# Altium project GeneralMainModule.PrjPcb
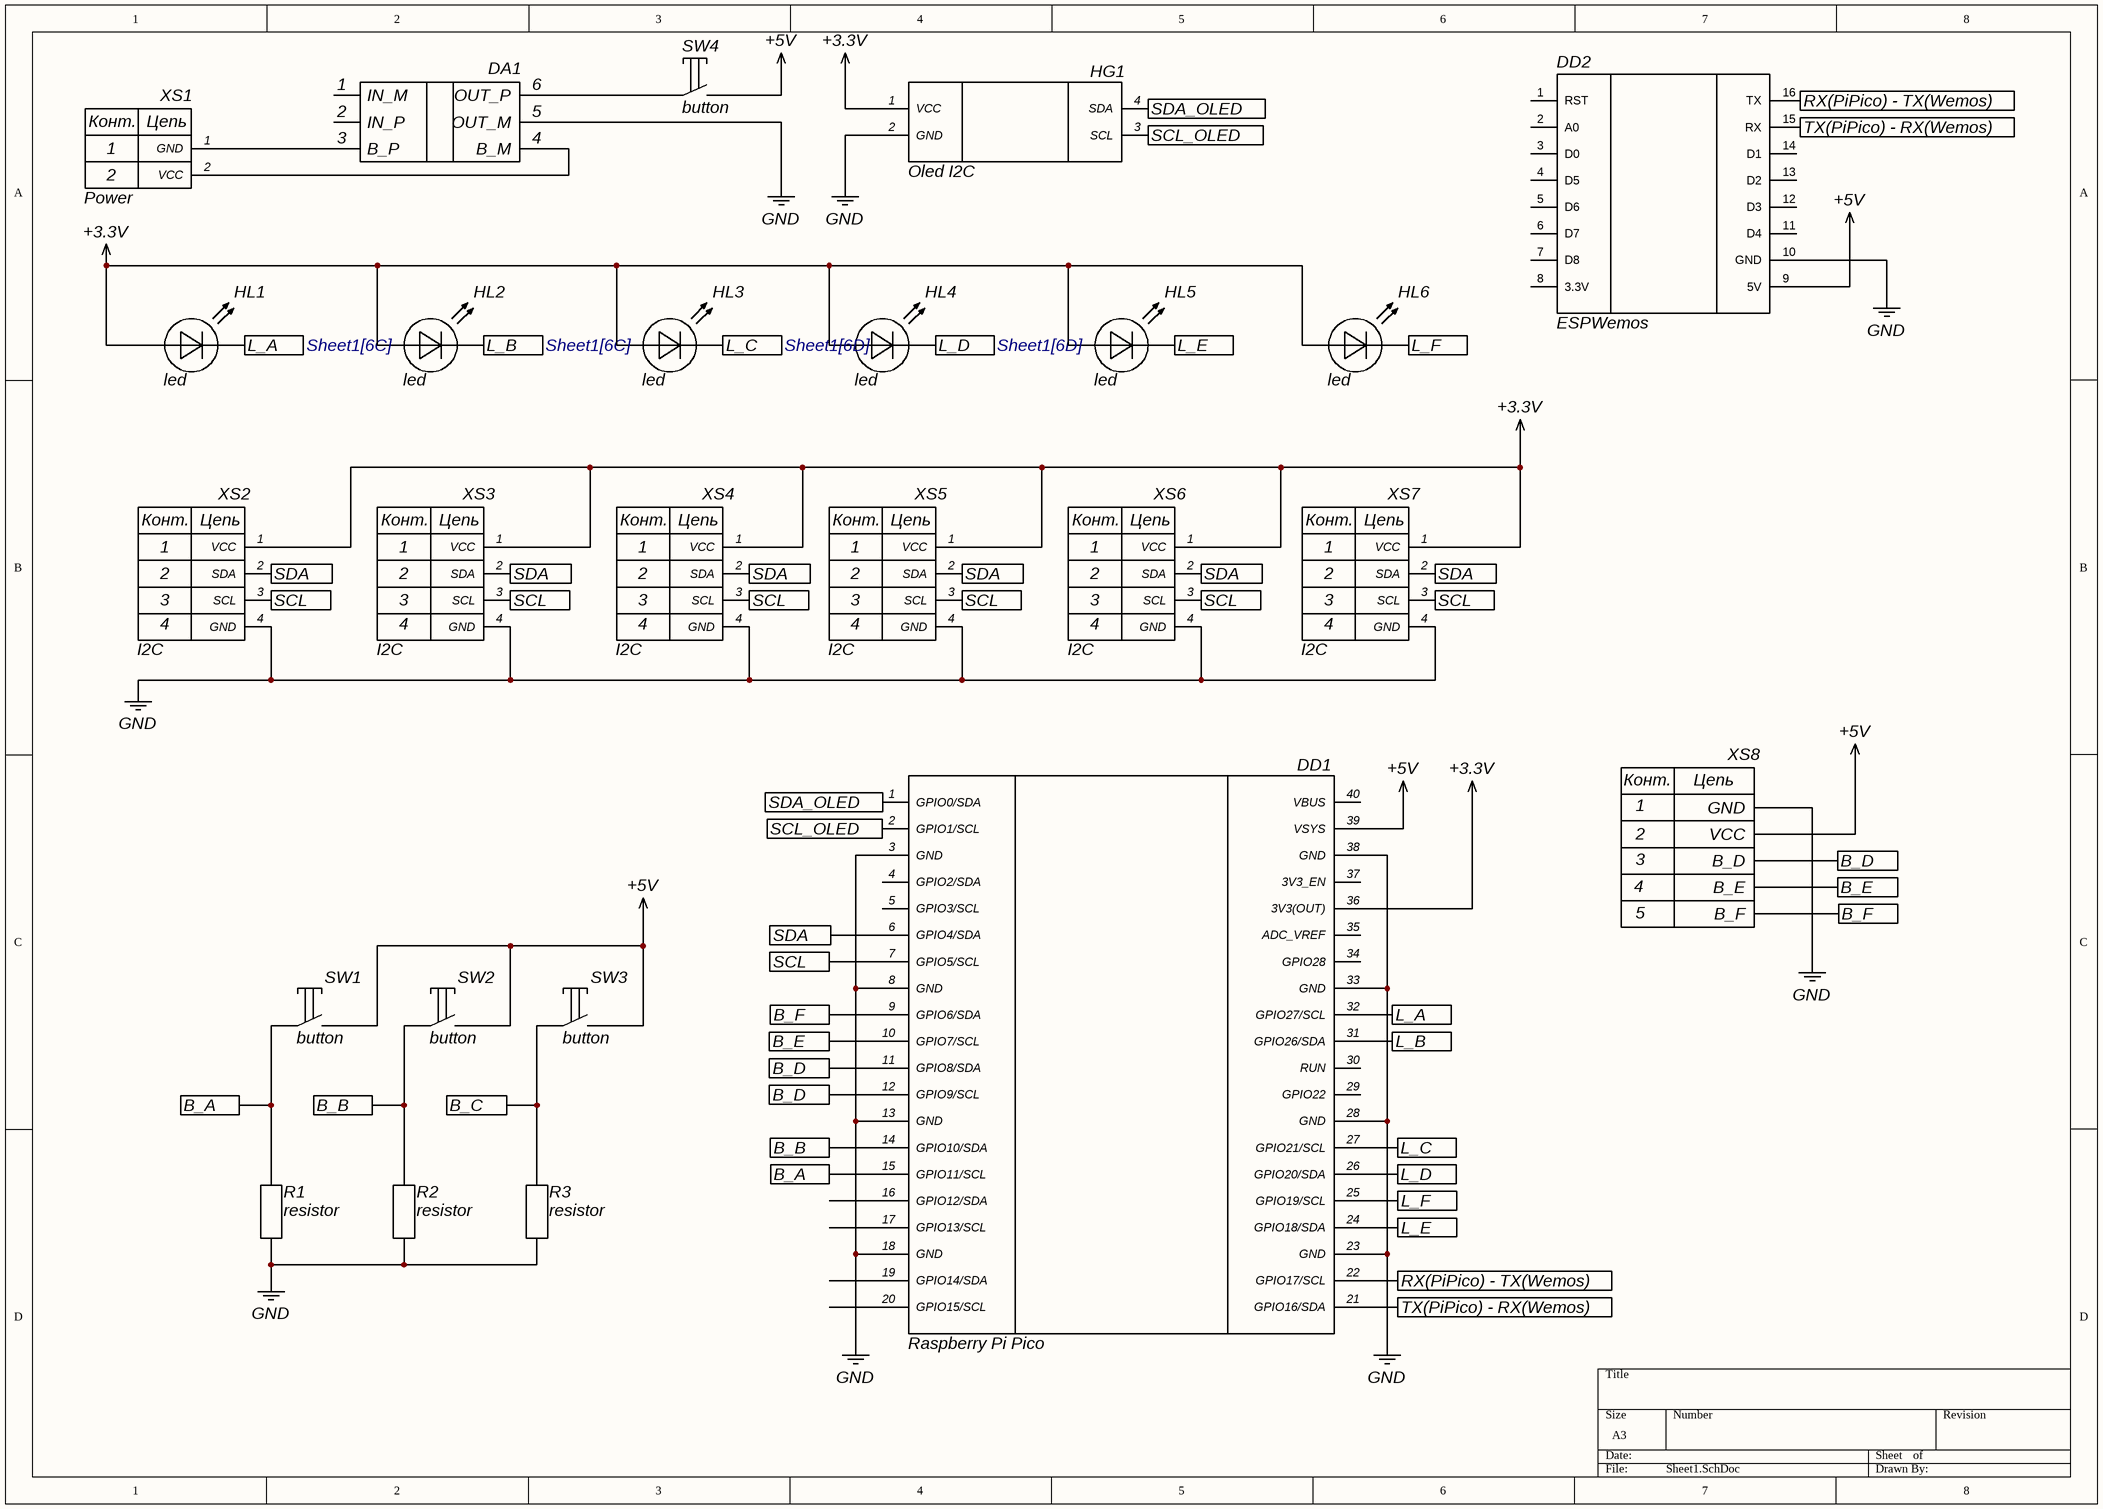
[diagram p0: Sheet1.SchDoc]
1 sheet, 25 parts. Net scope: flat (ports and power ports of the same name join across sheets).
Board files: PCB1.PcbDoc, PCB3.PcbDoc

## Sheet Sheet1.SchDoc
size A3; SheetNumber: 1; SheetTotal: 1

### Parts
DA1  1S 4057 BMS USB C  [TP4057]  (value not drawn)
DD1  Raspberry Pi Pico  [raspberryPiPico]
DD2  ESPWemos  [WEMOS]
HG1  Oled I2C  [OledI2C]
HL1  led  [LED]
HL2  led  [LED]
HL3  led  [LED]
HL4  led  [LED]
HL5  led  [LED]
HL6  led  [LED]
R1  resistor  [Resistor]
R2  resistor  [Resistor]
R3  resistor  [Resistor]
SW1  button  [button]
SW2  button  [button]
SW3  button  [button]
SW4  button  [PowerButton]
XS1  Power  [18650РHolder]
XS2  I2C  [gpio4 v2]
XS3  I2C  [gpio4 v2]
XS4  I2C  [gpio4 v2]
XS5  I2C  [gpio4 v2]
XS6  I2C  [gpio4 v2]
XS7  I2C  [gpio4 v2]
XS8  Connector  [ConnectionModule]  (value not drawn)

### Ports
B_A (see Sheet1[1C]), B_A (see Sheet1[3D]), B_B (see Sheet1[2C]), B_B (see Sheet1[3D]), B_C, B_D (see Sheet1[3C]), B_D (see Sheet1[3C], Sheet1[8C]), B_E (see Sheet1[3C]), B_E (see Sheet1[8C]), B_F (see Sheet1[3C]), B_F (see Sheet1[8C]), L_A (see Sheet1[1A]), L_A (see Sheet1[6C]), L_B (see Sheet1[2A]), L_B (see Sheet1[6C]), L_C (see Sheet1[3A]), L_C (see Sheet1[6D]), L_D (see Sheet1[4A]), L_D (see Sheet1[6D]), L_E (see Sheet1[5A]), L_E (see Sheet1[6D]), L_F (see Sheet1[6A]), L_F (see Sheet1[6D]), RX(PiPico) - TX(Wemos) (see Sheet1[6D]), RX(PiPico) - TX(Wemos) (see Sheet1[7A]), SCL (see Sheet1[2B], Sheet1[3B], Sheet1[3C], Sheet1[4B], Sheet1[5B]), SCL (see Sheet1[2B], Sheet1[3B], Sheet1[3C], Sheet1[4B], Sheet1[5B], Sheet1[6B]), SCL (see Sheet1[2B], Sheet1[3B], Sheet1[3C], Sheet1[4B], Sheet1[6B]), SCL (see Sheet1[2B], Sheet1[3B], Sheet1[3C], Sheet1[5B], Sheet1[6B]), SCL (see Sheet1[2B], Sheet1[3B], Sheet1[4B], Sheet1[5B], Sheet1[6B]), SCL (see Sheet1[2B], Sheet1[3C], Sheet1[4B], Sheet1[5B], Sheet1[6B]), SCL_OLED (see Sheet1[3C]), SCL_OLED (see Sheet1[5A]), SDA (see Sheet1[2B], Sheet1[3B], Sheet1[3C], Sheet1[4B], Sheet1[5B]), SDA (see Sheet1[2B], Sheet1[3B], Sheet1[3C], Sheet1[4B], Sheet1[5B], Sheet1[6B]), SDA (see Sheet1[2B], Sheet1[3B], Sheet1[3C], Sheet1[4B], Sheet1[6B]), SDA (see Sheet1[2B], Sheet1[3B], Sheet1[3C], Sheet1[5B], Sheet1[6B]), SDA (see Sheet1[2B], Sheet1[3B], Sheet1[4B], Sheet1[5B], Sheet1[6B]), SDA (see Sheet1[2B], Sheet1[3C], Sheet1[4B], Sheet1[5B], Sheet1[6B]), SDA_OLED (see Sheet1[3C]), SDA_OLED (see Sheet1[5A]), TX(PiPico) - RX(Wemos) (see Sheet1[6D]), TX(PiPico) - RX(Wemos) (see Sheet1[7A])

### Nets
+3.3V: DD1.36(3V3(OUT)) HG1.1(VCC) HL1.1(anode) HL2.1(anode) HL3.1(anode) HL4.1(anode) HL5.1(anode) HL6.1(anode) XS2.1(VCC) XS3.1(VCC) XS4.1(VCC) XS5.1(VCC) XS6.1(VCC) XS7.1(VCC)
+5V: DD1.39(VSYS) DD2.9(5V) SW1.2 SW2.2 SW3.2 SW4.2 XS8.2(VCC)
GND: DA1.5(OUT_M) DD1.3(GND) DD1.8(GND) DD1.13(GND) DD1.18(GND) DD1.23(GND) DD1.28(GND) DD1.33(GND) DD1.38(GND) DD2.10(GND) HG1.2(GND) R1.1 R2.1 R3.1 XS2.4(GND) XS3.4(GND) XS4.4(GND) XS5.4(GND) XS6.4(GND) XS7.4(GND) XS8.1(GND)
NetDA1_3: DA1.3(B_P) XS1.1(GND)
NetDA1_4: DA1.4(B_M) XS1.2(VCC)
NetDA1_6: DA1.6(OUT_P) SW4.1
NetDD1_1: DD1.1(GPIO0/SDA) HG1.4(SDA) ; port SDA_OLED
NetDD1_2: DD1.2(GPIO1/SCL) HG1.3(SCL) ; port SCL_OLED
NetDD1_6: DD1.6(GPIO4/SDA) XS2.2(SDA) XS3.2(SDA) XS4.2(SDA) XS5.2(SDA) XS6.2(SDA) XS7.2(SDA) ; port SDA
NetDD1_7: DD1.7(GPIO5/SCL) XS2.3(SCL) XS3.3(SCL) XS4.3(SCL) XS5.3(SCL) XS6.3(SCL) XS7.3(SCL) ; port SCL
NetDD1_9: DD1.9(GPIO6/SDA) XS8.5(B_F) ; port B_F
NetDD1_10: DD1.10(GPIO7/SCL) XS8.4(B_E) ; port B_E
NetDD1_11: DD1.11(GPIO8/SDA) DD1.12(GPIO9/SCL) XS8.3(B_D) ; port B_D
NetDD1_14: DD1.14(GPIO10/SDA) R2.2 SW2.1 ; port B_B
NetDD1_15: DD1.15(GPIO11/SCL) R1.2 SW1.1 ; port B_A
NetDD1_21: DD1.21(GPIO16/SDA) DD2.15(RX) ; port TX(PiPico) - RX(Wemos)
NetDD1_22: DD1.22(GPIO17/SCL) DD2.16(TX) ; port RX(PiPico) - TX(Wemos)
NetDD1_24: DD1.24(GPIO18/SDA) HL5.2(catode) ; port L_E
NetDD1_25: DD1.25(GPIO19/SCL) HL6.2(catode) ; port L_F
NetDD1_26: DD1.26(GPIO20/SDA) HL4.2(catode) ; port L_D
NetDD1_27: DD1.27(GPIO21/SCL) HL3.2(catode) ; port L_C
NetDD1_31: DD1.31(GPIO26/SDA) HL2.2(catode) ; port L_B
NetDD1_32: DD1.32(GPIO27/SCL) HL1.2(catode) ; port L_A
NetR3_2: R3.2 SW3.1 ; port B_C

Not connected (* = marked no-connect by the designer): DA1 1(IN_M) 2(IN_P); DD1 4(GPIO2/SDA) 5(GPIO3/SCL) 16(GPIO12/SDA) 17(GPIO13/SCL) 19(GPIO14/SDA) 20(GPIO15/SCL) 29(GPIO22) 30(RUN) 34(GPIO28) 35(ADC_VREF) 37(3V3_EN) 40(VBUS); DD2 1(RST) 2(A0) 3(D0) 4(D5) 5(D6) 6(D7) 7(D8) 8(3.3V) 11(D4) 12(D3) 13(D2) 14(D1)

### Notes on the sheet
- (in symbol ConnectionModule) Конт.; Цепь
- (in symbol GPIO4) Конт.; Цепь
- (in symbol Power) Конт.; Цепь

### Library data of the parts
DD2 = ESP8266Wemos
XS2-XS7 = GPIO4
XS8 = ConnectionModule: System: Connector